# Altium project FonteAjustavel.PrjPCB
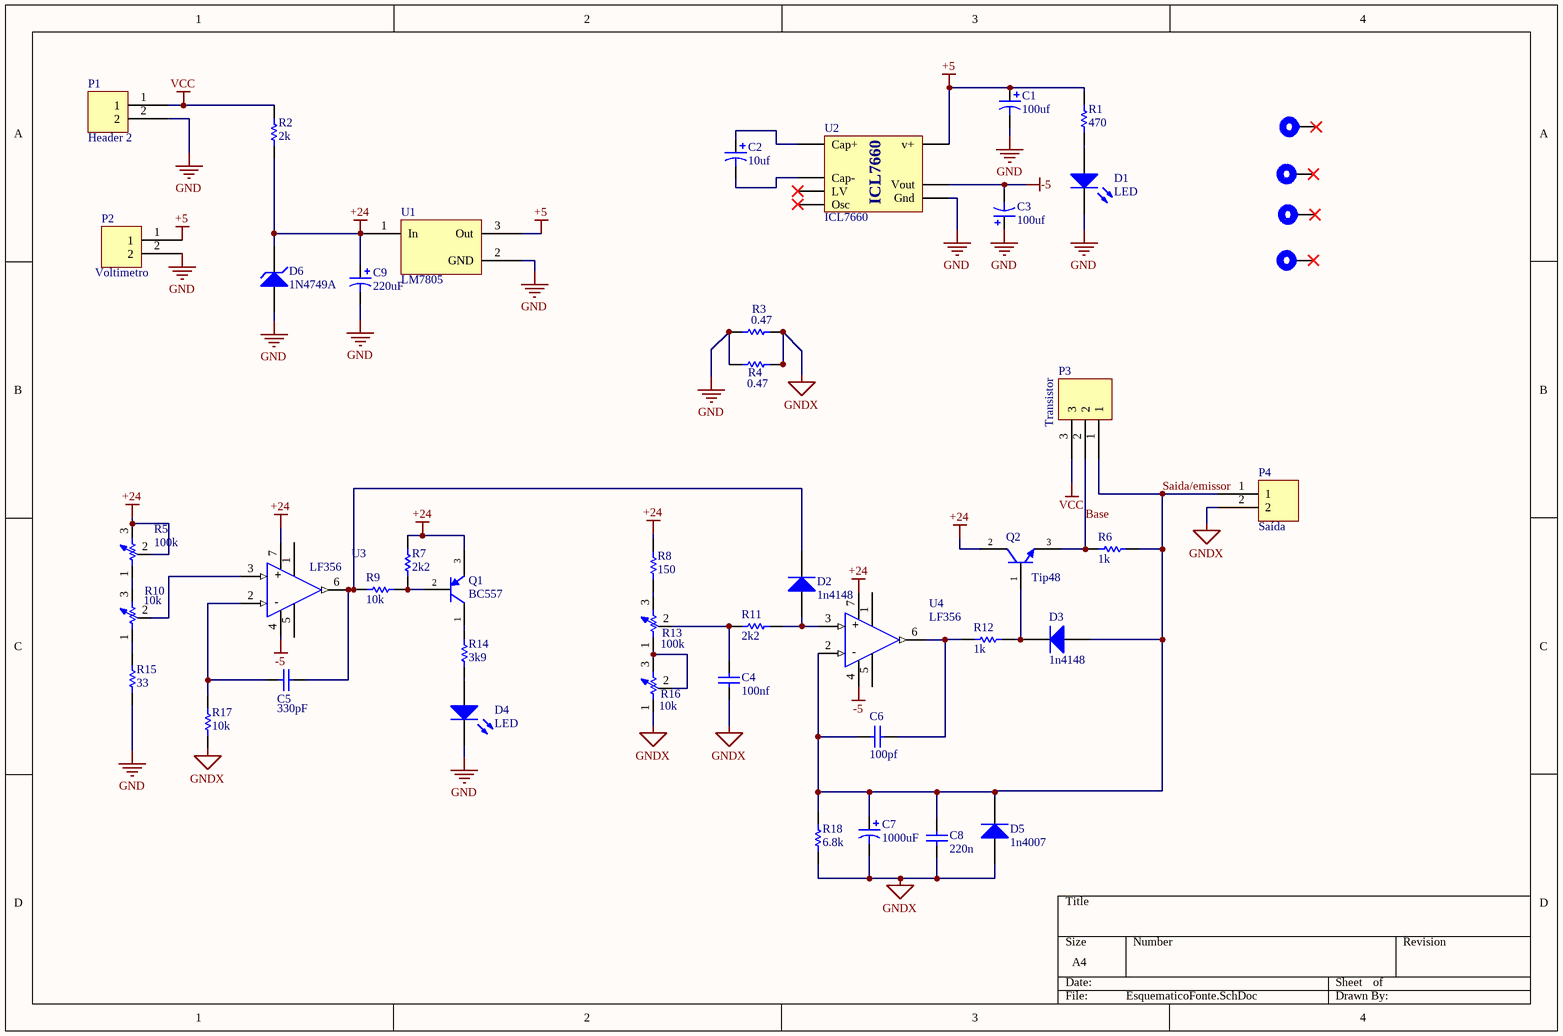
[diagram p0: EsquematicoFonte.SchDoc]
1 sheet, 47 parts. Net scope: global (net labels, ports and power ports of the same name join across sheets).
Board file: PCBFonte.PcbDoc

## Sheet EsquematicoFonte.SchDoc
size A4

### Parts
C1  100uf  [cap_rad_d6.3X11POL]
C2  10uf  [CAP_RAD_D5x11pol]
C3  100uf  [cap_rad_d6.3X11POL]
C4  100nf  [CAP_BOX_7.2x2.5x6.5_RD]
C5  330pF  [CAP_BOX_7.2x2.5x6.5_RD]
C6  100pf  [CAP_BOX_7.2x2.5x6.5_RD]
C7  1000uF  [cap_rad_d10X12.5POL]
C8  220n  [CAP_BOX_7.2x2.5x6.5_RD]
C9  220uF  [cap_rad_d10X12.5POL]
D1  LED  [LED_5MM_GREEN]
D2  1n4148  [DIODE-SIGNAL]
D3  1n4148  [DIODE-SIGNAL]
D4  LED  [LED_5MM_RED]
D5  1n4007  [DIODE-1N400X]
D6  1N4749A  [DIODE-SIGNAL]
H1  Hole  [HOLE_M3]  (value not drawn)
H2  Hole  [HOLE_M3]  (value not drawn)
H3  Hole  [HOLE_M3]  (value not drawn)
H4  Hole  [HOLE_M3]  (value not drawn)
P1  Header 2  [KRE-2]
P2  Voltimetro  [KRE-2]
P3  Transistor  [KRE-3]
P4  Saída  [KRE-2]
Q1  BC557  [TO-92]
Q2  Tip48  [TIP48]
R1  470  [AXIAL-0.4]
R2  2k  [AXIAL-0.4]
R3  0.47  [resistor 5W]
R4  0.47  [resistor 5W]
R5  100k  [VR1]
R6  1k  [AXIAL-0.4]
R7  2k2  [AXIAL-0.4]
R8  150  [AXIAL-0.4]
R9  10k  [AXIAL-0.4]
R10  10k  [PotenciometroDeitado]
R11  2k2  [AXIAL-0.4]
R12  1k  [AXIAL-0.4]
R13  100k  [PotenciometroDeitado]
R14  3k9  [AXIAL-0.4]
R15  33  [AXIAL-0.4]
R16  10k  [PotenciometroDeitado]
R17  10k  [AXIAL-0.4]
R18  6.8k  [AXIAL-0.4]
U1  LM7805  [LM7805]
U2  ICL7660  [ICL7660]
U3  LF356  [LF356]
U4  LF356  [LF356]

### Nets
+5: C1.1 P2.1 R1.1 U1.3(Out) U2.8(v+)
+24: C9.1 D6.2(K) Q1.3(E) Q2.2(C) R2.2 R5.2 R5.3 R7.1 R8.1 U1.1(In) U3.7 U4.7
-5: C3.2 U2.5(Vout) U3.4 U4.4
GND: C1.2 C3.1 C9.2 D1.2(K) D4.2(K) D6.1(A) P1.2 P2.2 R3.1 R4.1 R15.2 U1.2(GND) U2.3(Gnd)
GNDX: C4.1 C7.2 C8.2 D5.1(A) P4.2 R3.2 R4.2 R16.1 R17.2 R18.1
VCC: P1.1 P3.3 R2.1
Base: P3.2 Q2.3(E) R6.1
Saida/emissor: C6.2 C7.1 C8.1 D3.1(A) D5.2(K) P3.1 P4.1 R6.2 R18.2 U4.2(-)
NetC2_1: C2.1 U2.2(Cap+)
NetC2_2: C2.2 U2.4(Cap-)
NetC4_2: C4.2 R11.1 R13.2
NetC5_1: C5.1 R17.1 U3.2(-)
NetC5_2: C5.2 D2.2(K) R9.1 U3.6(VOUT)
NetC6_1: C6.1 R12.1 U4.6(VOUT)
NetD1_1: D1.1(A) R1.2
NetD2_1: D2.1(A) R11.2 U4.3(VIN)
NetD3_2: D3.2(K) Q2.1(B) R12.2
NetD4_1: D4.1(A) R14.2
NetQ1_1: Q1.1(C) R14.1
NetQ1_2: Q1.2(B) R7.2 R9.2
NetR5_1: R5.1 R10.3
NetR8_2: R8.2 R13.3
NetR10_1: R10.1 R15.1
NetR10_2: R10.2 U3.3(VIN)
NetR13_1: R13.1 R16.2 R16.3

Not connected (* = marked no-connect by the designer): H1 1*; H2 1*; H3 1*; H4 1*; U2 6(LV)* 7(Osc)*; U3 1 5; U4 1 5

### Notes on the sheet
- (in symbol LF356) +

### Library data of the parts
C1-C3 C7 C9 = CP: Polarized Capacitor; Manufacturer: *; PartNumber: *; Package Type: *; Value: *
C4-C6 C8 = C: Capacitor; Value: 1; Manufacturer: *; PartNumber: *; Package Type: *
D2 D3 D5 = D: Diode; Manufacturer: *; PartNumber: *; Package Type: *
D6 = D Zener: Zener Diode; Manufacturer: *; PartNumber: *; Package Type: *
P2 P4 = Header 2
P3 = Header 3
Q1 = PNP: PNP Bipolar Transistor; Manufacturer: *; PartNumber: *; Package Type: *
R1-R4 R6-R9 R11 R12 R14 R15 R17 R18 = R: Resistor; Value: 0; Manufacturer: *; PartNumber: *; Package Type: *
R5 R10 R13 R16 = R Adj: Variable Resistor; Manufacturer: *; PartNumber: *; Package Type: *; Value: *; Set Position: *
D1 D4 = LED: Manufacturer: *; PartNumber: *; Package Type: *